# EAGLE design main4 (EAGLE 7.5.0)
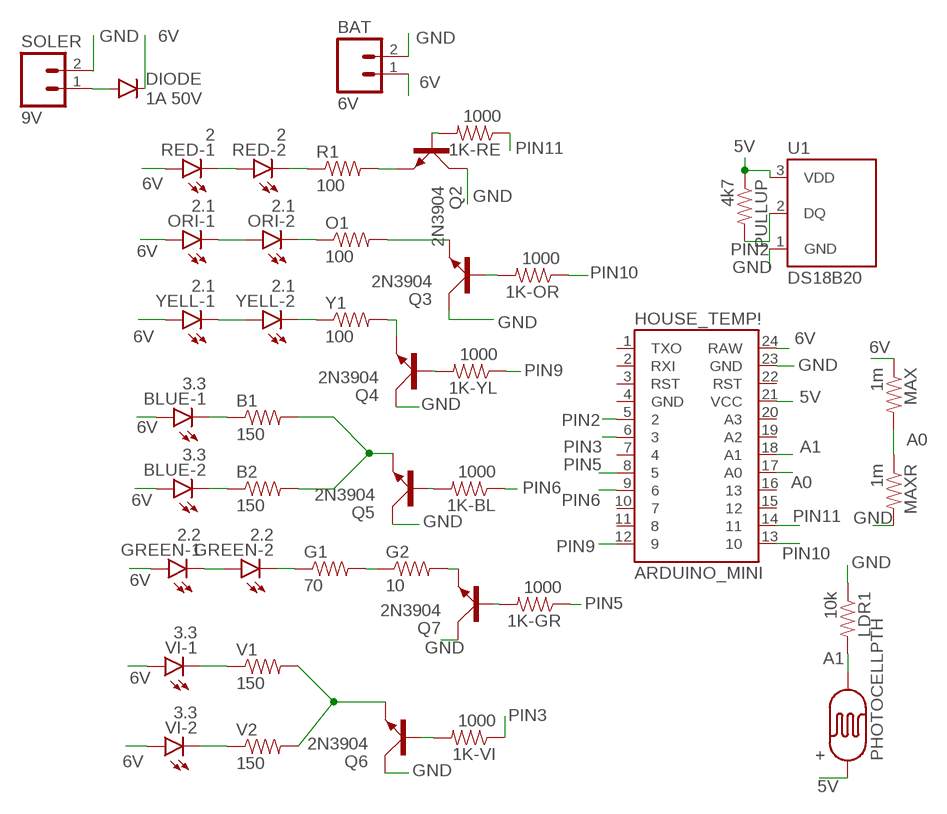
[diagram p0: schematic, sheet 1]

## Parts
1K-BL  1000  RESISTORAXIAL-0.3  [AXIAL-0.3]
1K-GR  1000  RESISTORAXIAL-0.3  [AXIAL-0.3]
1K-OR  1000  RESISTORAXIAL-0.3  [AXIAL-0.3]
1K-RE  1000  RESISTORAXIAL-0.3  [AXIAL-0.3]
1K-VI  1000  RESISTORAXIAL-0.3  [AXIAL-0.3]
1K-YL  1000  RESISTORAXIAL-0.3  [AXIAL-0.3]
+  PHOTOCELLPTH  [PHOTOCELL]
B1  150  RESISTORAXIAL-0.3  [AXIAL-0.3]
B2  150  RESISTORAXIAL-0.3  [AXIAL-0.3]
BAT  6V  M02PTH  [1X02]
BLUE-1  3.3  LED10MM  [LED10MM]
BLUE-2  3.3  LED10MM  [LED10MM]
DIODE  1A 50V  DIODEPTH  [DIODE-1N4001]
G1  70  RESISTORAXIAL-0.3  [AXIAL-0.3]
G2  10  RESISTORAXIAL-0.3  [AXIAL-0.3]
GREEN-1  2.2  LED10MM  [LED10MM]
GREEN-2  2.2  LED10MM  [LED10MM]
HOUSE_TEMP!  ARDUINO_MINI  [ARDUINO_MINI]
LDR1  10k  RESISTORAXIAL-0.3  [AXIAL-0.3]
MAX  1m  RESISTORAXIAL-0.3  [AXIAL-0.3]
MAXR  1m  RESISTORAXIAL-0.3  [AXIAL-0.3]
O1  100  RESISTORAXIAL-0.3  [AXIAL-0.3]
ORI-1  2.1  LED10MM  [LED10MM]
ORI-2  2.1  LED10MM  [LED10MM]
PULLUP  4k7  RESISTORAXIAL-0.3  [AXIAL-0.3]
Q2  2N3904  [TO92D]
Q3  2N3904  [TO92D]
Q4  2N3904  [TO92D]
Q5  2N3904  [TO92D]
Q6  2N3904  [TO92D]
Q7  2N3904  [TO92D]
R1  100  RESISTORAXIAL-0.3  [AXIAL-0.3]
RED-1  2  LED10MM  [LED10MM]
RED-2  2  LED10MM  [LED10MM]
SOLER  9V  M02PTH  [1X02]
U1  DS18B20  [TO-92-AMMO]
V1  150  RESISTORAXIAL-0.3  [AXIAL-0.3]
V2  150  RESISTORAXIAL-0.3  [AXIAL-0.3]
VI-1  3.3  LED10MM  [LED10MM]
VI-2  3.3  LED10MM  [LED10MM]
Y1  100  RESISTORAXIAL-0.3  [AXIAL-0.3]
YELL-1  2.1  LED10MM  [LED10MM]
YELL-2  2.1  LED10MM  [LED10MM]

## Nets
5V: +.1 HOUSE_TEMP!.21(VCC) PULLUP.P$1 U1.3(VDD)
6V: BAT.1 BLUE-1.A BLUE-2.A DIODE.C GREEN-1.A HOUSE_TEMP!.24(RAW) MAX.P$1 ORI-1.A RED-1.A VI-1.A VI-2.A YELL-1.A
A0: HOUSE_TEMP!.17(A0) MAX.P$2 MAXR.P$1
A1: +.2 HOUSE_TEMP!.18(A1) LDR1.P$2
BLU: B1.P$1 BLUE-1.C
BLU2: B2.P$1 BLUE-2.C
GND: BAT.2 HOUSE_TEMP!.23(GND) LDR1.P$1 MAXR.P$2 Q2.C Q3.C Q4.C Q5.C Q6.C Q7.C SOLER.2 U1.1(GND)
GREEN-2: G1.P$1 GREEN-2.C
GREN: GREEN-1.C GREEN-2.A
N$5: R1.P$1 RED-2.C
N$6: DIODE.A SOLER.1
N$7: Y1.P$1 YELL-2.C
N$9: Q4.E Y1.P$2
N$12: B1.P$2 B2.P$2 Q5.E
N$14: Q6.E V1.P$2 V2.P$2
N$15: Q2.E R1.P$2
N$16: O1.P$2 Q3.E
N$17: G1.P$2 G2.P$1
N$18: G2.P$2 Q7.E
N$20: 1K-VI.P$2 Q6.B
N$21: 1K-GR.P$2 Q7.B
N$22: 1K-BL.P$2 Q5.B
N$23: 1K-YL.P$2 Q4.B
N$24: 1K-OR.P$2 Q3.B
N$25: 1K-RE.P$2 Q2.B
O1: O1.P$1 ORI-2.C
ORI: ORI-1.C ORI-2.A
PIN2: HOUSE_TEMP!.5 PULLUP.P$2 U1.2(DQ)
PIN3: 1K-VI.P$1 HOUSE_TEMP!.6
PIN5: 1K-GR.P$1 HOUSE_TEMP!.8
PIN6: 1K-BL.P$1 HOUSE_TEMP!.9
PIN9: 1K-YL.P$1 HOUSE_TEMP!.12
PIN10: 1K-OR.P$1 HOUSE_TEMP!.13
PIN11: 1K-RE.P$1 HOUSE_TEMP!.14
RED: RED-1.C RED-2.A
VI: V1.P$1 VI-1.C
VI2: V2.P$1 VI-2.C
YEL: YELL-1.C YELL-2.A
Unconnected: HOUSE_TEMP!.1(TXO) HOUSE_TEMP!.2(RXI) HOUSE_TEMP!.3(RST) HOUSE_TEMP!.4(GND) HOUSE_TEMP!.7 HOUSE_TEMP!.10 HOUSE_TEMP!.11 HOUSE_TEMP!.15 HOUSE_TEMP!.16 HOUSE_TEMP!.19(A2) HOUSE_TEMP!.20(A3) HOUSE_TEMP!.22(RST)

## Library data of the parts
1K-BL 1K-GR 1K-OR 1K-RE 1K-VI 1K-YL B1 MAX MAXR O1 PULLUP R1 V1 Y1 = SparkFun-Passives:RESISTOR: Resistor Basic schematic elements and footprints for 0603, 1206, and PTH resistors.
+ = SparkFun-Sensors:PHOTOCELL: CdS photoresistor. This is a low cost way to detect light levels. Resistance decreases with more incoming light. SparkFun SKU: SEN-09088
B2 G1 G2 LDR1 V2 = SparkFun-Resistors:RESISTOR: Resistor Basic schematic elements and footprints for 0603, 1206, and PTH resistors.
BAT SOLER = SparkFun-Connectors:M02: Standard 2-pin 0.1" header. Use with - straight break away headers ( PRT-00116) - right angle break away headers (PRT-00553) - swiss pins (PRT-00743) - machine pins (PRT-00117) - female headers (PRT-00115) Molex polarized connector foot print use with: PRT-08233 with associated crimp pins and housings. 2.54_SCREWTERM for use with PRT-10571. 3.5mm Screw Terminal footprints for PRT-08084 5mm Screw Terminal footprints for use with PRT-08432
BLUE-1 BLUE-2 GREEN-1 GREEN-2 ORI-1 ORI-2 RED-1 RED-2 VI-1 VI-2 YELL-1 YELL-2 = SparkFun-LED:LED: LEDs Standard schematic elements and footprints for 5mm, 3mm, 1206, and 0603 sized LEDs. 5mm - Spark Fun Electronics SKU : COM-00529 (and others)
DIODE = SparkFun-DiscreteSemi:DIODE: Diode These are standard reverse protection diodes and small signal diodes. SMA package can handle up to about 1A. SOD-323 can handle about 200mA. What the SOD-323 package when ordering, there are some mfgs out there that are 5-pin packages.
HOUSE_TEMP! = SparkFun-Boards:ARDUINO_MINI: Arduino Pro Mini footprint
Q2-Q7 = transistor-small-signal:2N3904: NPN TRANSISTOR
U1 = SparkFun-Sensors:DS18B20: Dallas/Maxim DS18B20 1-wire temperature sensor Datasheet: http://datasheets.maximintegrated.com/en/ds/DS18B20.pdf temp thermometer 1-wire one-wire one wire; STORE_ID: SEN-00245

## Board
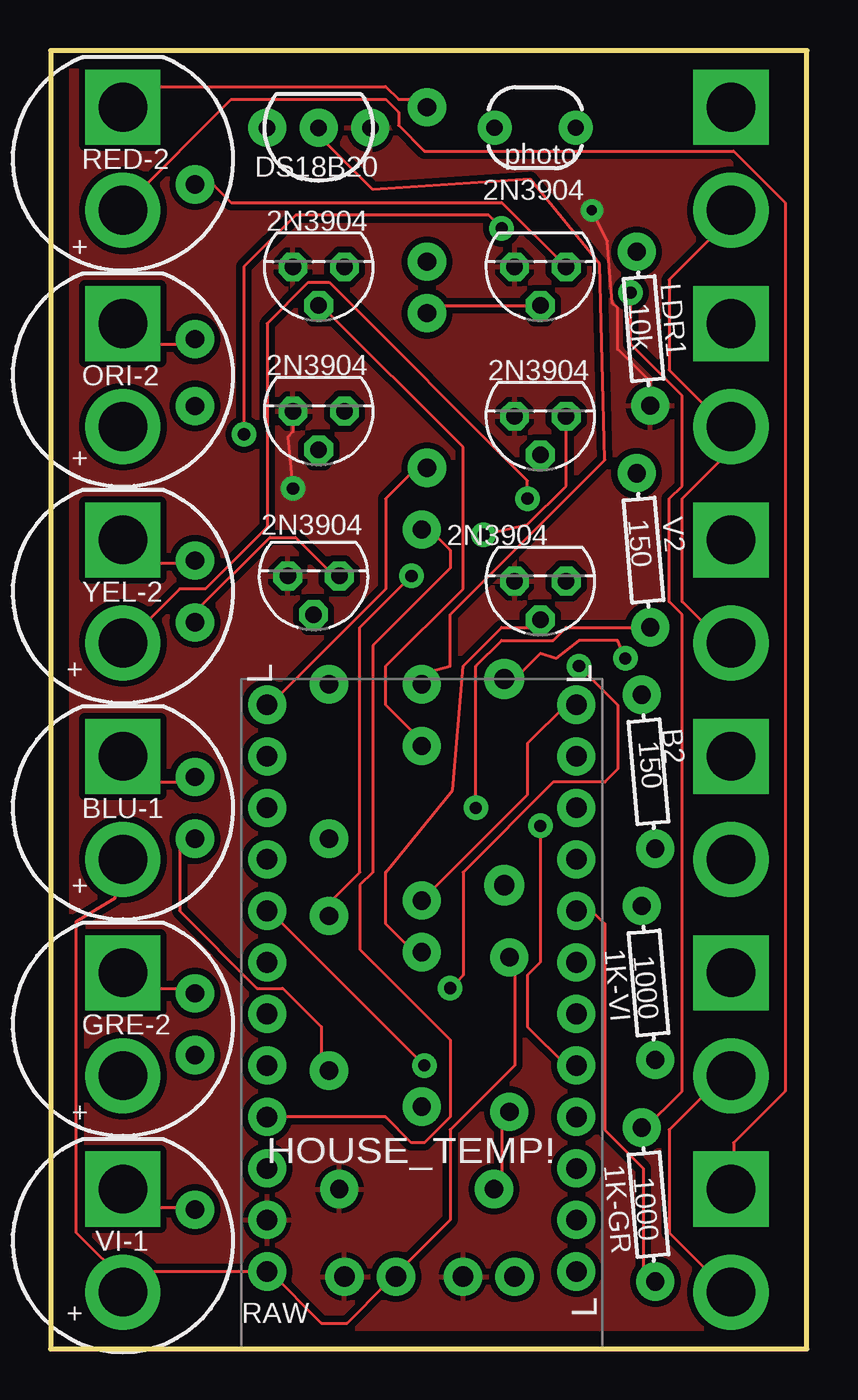
[diagram p1: board, top side]
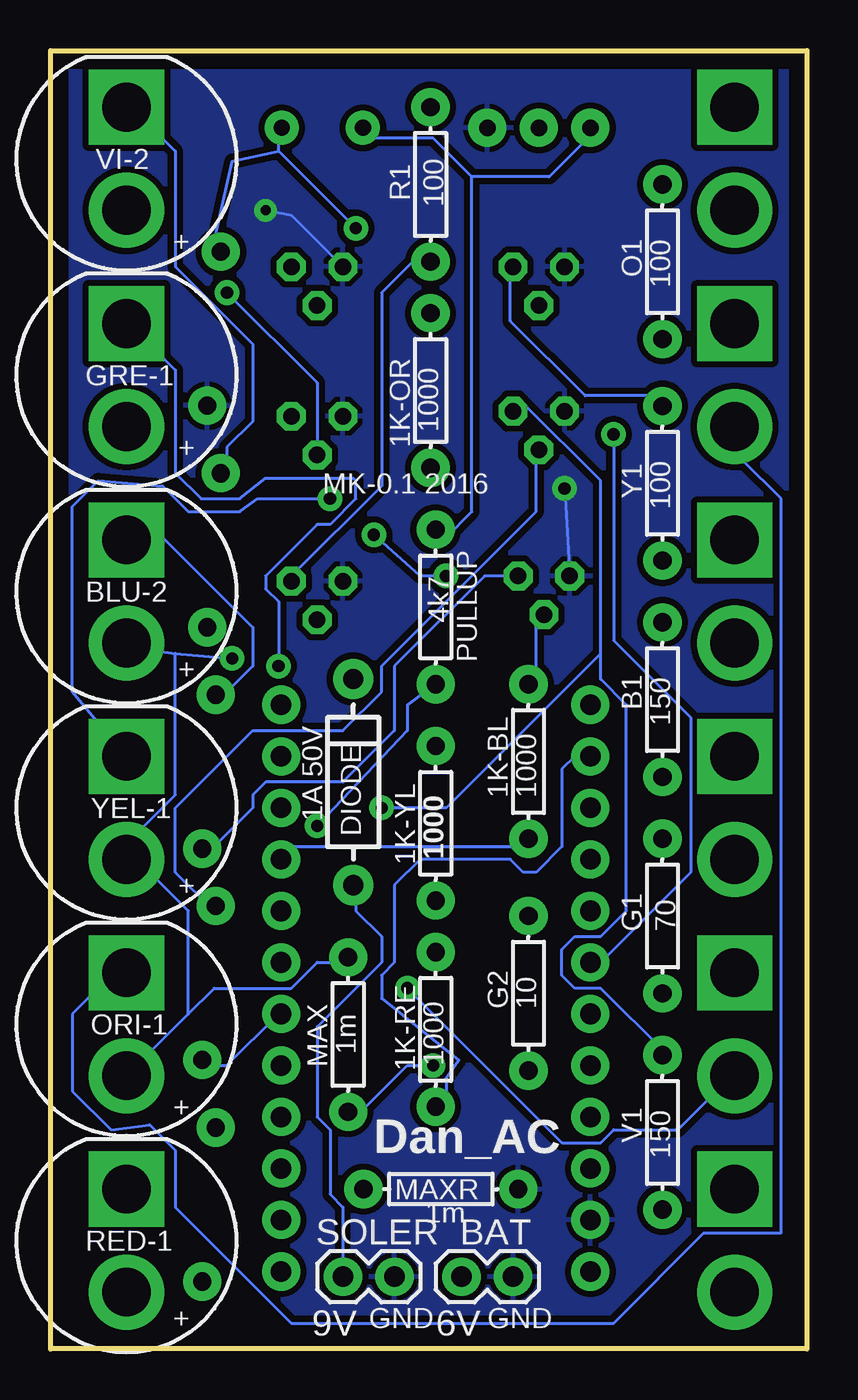
[diagram p2: board, bottom side, seen from below]

Size 37.26 x 64 mm. Coordinates in mm from the lower left corner, seen from the top.
Outline: 0,0 37.26,0 37.26,64 0,64 0,0
Copper layers (1*16): Top 0.035mm / dielectric 1.5mm / Bottom 0.035mm
Design rules "default *": minimum track width 6mil, minimum drill 0.5mm, track to track 8mil, track to pad 8mil, pad to pad 8mil, via to via 8mil, smd to smd 8mil, copper to edge 30mil, drill to drill 8mil, minimum pad ring 12mil, minimum via ring 12mil, stop-mask expansion 8mil, vias tented up to drill 25mil, thermal gap 10mil

### Footprints (pad centres in the part's own frame; a part is rotated, then mirrored left to right if it is on the bottom)
AXIAL-0.3 = drill 0.9 pad 1.88: P$1 -3.81,0; P$2 3.81,0
PHOTOCELL = drill 0.8 pad 1.676: 1 -2,0; 2 2,0
1X02 = drill 1.016 pad 1.88: 1 0,0; 2 2.54,0
LED10MM = drill 2.4 pad 3.7: A 2.54,0 | drill 2.4 pad 3.7 square: C -2.54,0
DIODE-1N4001 = drill 1 pad 1.981: A -5.08,0; C 5.08,0
ARDUINO_MINI = drill 1.016 pad 1.88: 1 -7.62,12.7; 2 -7.62,10.16; 3 -7.62,7.62; 4 -7.62,5.08; 5 -7.62,2.54; 6 -7.62,0; 7 -7.62,-2.54; 8 -7.62,-5.08; 9 -7.62,-7.62; 10 -7.62,-10.16; 11 -7.62,-12.7; 12 -7.62,-15.24; 13 7.62,-15.24; 14 7.62,-12.7; 15 7.62,-10.16; 16 7.62,-7.62; 17 7.62,-5.08; 18 7.62,-2.54; 19 7.62,0; 20 7.62,2.54; 21 7.62,5.08; 22 7.62,7.62; 23 7.62,10.16; 24 7.62,12.7
TO92D = drill 0.813 octagon: B 0,1.905; C 1.27,0; E -1.27,0
TO-92-AMMO = drill 0.813 pad 1.88: 1 -2.54,0; 2 0,0; 3 2.54,0

### Placement (x,y rotation side)
1K-BL  13.72,28.96 90 bottom
1K-GR  29.46,7.11 95 top
1K-OR  18.54,47.24 90 bottom
1K-RE  18.29,15.75 90 bottom
1K-VI  29.46,18.03 95 top
1K-YL  18.29,25.91 90 bottom
+  23.88,60.2 0 top
B1  7.11,32 90 bottom
B2  29.46,28.45 275 top
BAT  17.02,3.56 0 bottom
BLUE-1  3.56,26.67 270 top
BLUE-2  33.53,37.34 270 bottom
DIODE  22.35,27.94 90 bottom
G1  7.11,21.34 90 bottom
G2  13.72,17.53 90 bottom
GREEN-1  33.53,48.01 270 bottom
GREEN-2  3.56,16 270 top
HOUSE_TEMP!  18.29,16.51 180 top
LDR1  29.21,50.29 95 top
MAX  22.61,15.49 270 bottom
MAXR  18.03,7.87 0 bottom
O1  7.11,53.59 90 bottom
ORI-1  33.53,16 270 bottom
ORI-2  3.56,48.01 270 top
PULLUP  18.29,36.58 270 bottom
Q2  24.13,37.85 180 top
Q3  24.13,53.34 180 top
Q4  13.21,53.34 180 top
Q5  12.95,38.1 180 top
Q6  13.21,46.23 180 top
Q7  24.13,45.97 180 top
R1  18.54,57.4 270 bottom
RED-1  33.53,5.33 270 bottom
RED-2  3.56,58.67 270 top
SOLER  22.86,3.56 0 bottom
U1  13.21,60.2 180 top
V1  7.11,10.67 90 bottom
V2  29.21,39.37 275 top
VI-1  3.56,5.33 270 top
VI-2  33.53,58.67 270 bottom
Y1  7.11,42.67 90 bottom
YELL-1  33.53,26.67 270 bottom
YELL-2  3.56,37.34 270 top

### Tracks (layer width: path | path; a pad name or v marks a point on that pad's centre or on a via)
5V
  Top 0.152: HOUSE_TEMP!.21 16.51,11.43 17.78,10.16 18.41,10.16 19.68,11.43 19.68,15.24 15.24,19.69 15.24,22.86 15.88,23.5 15.88,34.67 19.68,38.48 19.68,39.37 18.41,40.64 PULLUP.P$1
  Bottom 0.152: 16.51,57.78 18.41,59.69 21.59,59.69 +.1 | 16.51,57.78 12.7,57.78 10.79,59.69 U1.3 | 16.51,57.78 16.51,41.27 17.78,40 PULLUP.P$1
6V  (via drill 0.6 pad 0.25)
  Top 0.152: 3.81,3.18 4.45,3.81 HOUSE_TEMP!.24 10.79,3.81 13.34,1.27 14.61,1.27 16.51,3.18 BAT.1 17.14,3.81 19.68,6.35 19.68,10.79 22.86,13.97 22.86,19.05 MAX.P$1 | 3.81,3.18 1.27,5.71 1.27,21.08 3.17,22.23 3.17,24.13 BLUE-1.A | 3.81,3.18 VI-1.A | VI-2.A 33.66,55.88 30.48,52.7 30.48,48.26 33.02,45.72 GREEN-1.A 33.53,45.09 33.02,43.81 31.11,41.91 31.11,36.83 33.02,34.92 BLUE-2.A | v28.32,34.04 27.94,34.92 26.04,34.92 24.89,34.04 24.13,34.29 22.86,33.02 DIODE.C | RED-1.A 33.02,3.18 30.48,5.71 30.48,10.79 33.02,13.33 ORI-1.A
  Bottom 0.152: 31.11,34.29 33.02,34.54 BLUE-2.A | 31.11,34.29 v28.32,34.04 | ORI-1.A 30.48,16.51 | 30.48,16.51 29.21,17.78 25.4,17.78 24.13,19.05 22.86,19.05 MAX.P$1 | 33.02,24.13 30.48,21.59 30.48,16.51 | 31.11,34.29 31.11,27.3 33.02,25.4 33.02,24.13 | 33.02,24.13 YELL-1.A
A0  (via drill 0.6 pad 0.25)
  Top 0.152: MAXR.P$1 22.23,8.25 22.23,11.43 MAX.P$2 | v18.41,13.97 10.79,21.59 HOUSE_TEMP!.17
  Bottom 0.152: v18.41,13.97 19.68,13.97 22.23,11.43 MAX.P$2
A1  (via drill 0.6 pad 0.25)
  Top 0.152: v9.53,45.09 9.53,53.34 12.06,55.88 21.59,55.88 v22.23,55.24
  Bottom 0.152: 26.04,59.05 28.32,58.55 29.21,54.61 LDR1.P$2 | 26.04,59.05 26.04,59.69 +.2 | v9.53,45.09 9.53,34.92 5.71,31.11 5.71,23.5 10.16,19.05 HOUSE_TEMP!.18 | 26.04,59.05 v22.23,55.24
BLU
  Top 0.152: B1.P$1 6.99,27.94 5.08,27.94 3.81,29.21 BLUE-1.C
BLU2
  Bottom 0.152: B2.P$1 28.57,32.38 27.3,33.66 27.3,35.56 31.75,40 33.02,40 BLUE-2.C
GND  (via drill 0.5 pad 0.25, 0.6 pad 0.25)
  Top 0.152: LDR1.P$1 29.54,47.67 27.94,49.28 27.94,51.31 27.69,51.56 27.43,54.61 v26.67,56.13 | Q6.C 11.94,45.21 11.68,44.96 v11.94,42.42
  Bottom 0.152: v26.67,56.13 25.4,55.88 Q3.C | v11.94,42.42 Q5.C
  pour Top (isolate 0.305): 0,64.01 37.34,64.01 37.34,0 0,0
  pour Bottom (isolate 0.305): 0,64.01 37.34,64.01 37.34,0 0,0
GREEN-2
  Top 0.152: G1.P$1 6.99,17.78 4.45,17.78 3.81,18.42 GREEN-2.C
GREN  (via drill 0.6 pad 0.25)
  Top 0.152: v19.68,17.78 20.32,18.42 20.32,23.5 24.77,27.94 27.3,27.94 27.94,28.57 27.94,31.75 v26.04,33.66
  Bottom 0.152: v19.68,17.78 12.06,10.16 10.16,10.16 9.53,10.79 6.35,10.79 3.81,13.33 GREEN-2.A | v26.04,33.66 26.04,36.83 26.67,37.46 26.67,38.1 24.13,40.64 23.5,40.64 22.23,41.91 22.23,42.8 22.35,42.93 26.67,42.93 27.94,41.91 29.84,41.91 31.11,43.18 31.11,48.26 33.02,50.16 GREEN-1.C
N$5
  Top 0.152: R1.P$1 18.41,61.59 17.14,61.59 16.51,62.23 4.45,62.23 3.81,61.59 RED-2.C
N$6
  Bottom 0.152: SOLER.1 22.86,6.98 23.5,7.62 23.5,10.79 24.13,11.43 24.13,15.87 20.95,19.05 20.95,20.32 22.23,21.59 22.23,22.86 DIODE.A
N$7
  Top 0.152: Y1.P$1 6.99,38.73 4.45,38.73 3.81,39.37 YELL-2.C
N$9
  Bottom 0.152: Q4.E 14.61,53.34 14.61,50.67 10.92,46.99 7.62,46.99 Y1.P$2
N$12
  Top 0.152: Q5.E 13.97,38.1 12.06,40 10.79,40 6.99,36.2 B1.P$2
  Bottom 0.152: Q5.E 15.88,38.1 20.32,33.66 20.32,30.48 22.86,27.94 26.67,27.94 27.3,27.3 27.3,26.67 29.21,24.77 B2.P$2
N$14  (via drill 0.6 pad 0.25)
  Top 0.152: v20.95,26.67 20.95,33.66 22.23,34.92 24.77,34.92 25.4,35.56 29.21,35.56 V2.P$2
  Bottom 0.152: 10.16,34.29 10.16,33.02 8.89,31.75 8.89,21.59 10.16,20.32 11.43,20.32 12.06,19.69 12.06,18.42 11.43,17.78 10.16,17.78 6.99,14.6 V1.P$2 | 10.16,34.29 10.16,42.8 13.97,46.61 Q6.E | v20.95,26.67 17.78,26.67 10.16,34.29
N$15
  Bottom 0.152: Q2.E 25.4,38.1 20.95,42.54 20.95,52.07 19.05,53.97 R1.P$2
N$16
  Top 0.152: Q3.E 22.23,56.52 8.89,56.52 7.62,57.78 O1.P$2
N$17
  Top 0.152: G2.P$1 13.34,13.97 13.34,15.87 11.43,17.78 10.16,17.78 6.35,21.59 6.35,24.77 6.99,25.4 G1.P$2
N$18  (via drill 0.6 pad 0.25)
  Top 0.152: Q7.E 25.4,42.54 23.5,40.64 v21.34,40.13 | v17.78,38.1 15.24,35.56 15.24,23.5 13.34,21.59 G2.P$2
  Bottom 0.152: v21.34,40.13 19.05,38.1 v17.78,38.1
N$20
  Bottom 0.152: Q6.B 13.34,43.81 13.34,41.27 20.95,33.66 20.95,32.38 22.86,30.48 27.3,30.48 31.11,26.67 31.11,23.5 29.21,21.59 1K-VI.P$2
N$21  (via drill 0.6 pad 0.25)
  Top 0.152: v28.57,52.07 28.57,49.53 31.11,46.99 31.11,42.54 30.48,41.91 30.48,36.83 31.11,36.2 31.11,12.7 29.21,10.79 1K-GR.P$2
  Bottom 0.152: Q7.B 24.13,47.62 v28.57,52.07
N$22
  Bottom 0.152: Q5.B 13.34,36.2 13.34,33.02 1K-BL.P$2
N$23
  Top 0.152: Q4.B 13.34,51.43 20.32,44.45 20.32,37.46 16.51,33.66 16.51,31.75 18.41,29.85 1K-YL.P$2
N$24
  Top 0.152: Q3.B 19.05,51.43 1K-OR.P$2
N$25
  Top 0.152: Q2.B 24.13,35.56 22.23,35.56 20.32,33.66 19.81,27.56 16.51,23.5 16.51,20.96 17.78,19.69 1K-RE.P$2
O1
  Top 0.152: O1.P$1 6.99,49.53 4.45,49.53 3.81,50.16 ORI-2.C
ORI
  Bottom 0.152: ORI-2.A 3.17,45.09 3.17,43.81 1.27,41.91 1.27,5.71 5.08,5.71 9.53,1.27 25.4,1.27 31.11,6.98 31.11,9.78 32.38,11.05 34.29,10.79 36.2,12.7 36.2,16.51 33.66,19.05 ORI-1.C
PIN2  (via drill 0.6 pad 0.25)
  Top 0.152: v24.13,25.78 24.13,19.05 23.5,18.42 23.5,15.87 25.4,13.97 HOUSE_TEMP!.5 | U1.2 13.34,59.69 15.88,57.15 23.62,57.66 27.05,53.47 27.3,43.81 19.68,36.2 19.68,33.66 18.67,33.4 PULLUP.P$2
  Bottom 0.152: v24.13,25.78 19.68,30.48 19.68,31.75 18.67,32.51 PULLUP.P$2
PIN3
  Bottom 0.152: HOUSE_TEMP!.6 26.04,16.51 28.57,13.97 29.21,13.97 1K-VI.P$1
PIN5
  Top 0.152: HOUSE_TEMP!.8 26.67,21.59 27.3,20.96 27.3,10.79 29.21,8.89 29.21,3.81 1K-GR.P$1
PIN6
  Bottom 0.152: 1K-BL.P$1 13.97,24.77 25.4,24.77 26.04,24.13 HOUSE_TEMP!.9
PIN9
  Top 0.152: 1K-YL.P$1 23.5,27.3 23.5,29.85 25.4,31.75 HOUSE_TEMP!.12
PIN10
  Top 0.152: HOUSE_TEMP!.13 10.79,31.75 16.51,37.46 16.51,41.91 18.41,43.81 1K-OR.P$1
PIN11
  Bottom 0.152: HOUSE_TEMP!.14 11.43,29.21 12.06,28.57 12.06,24.77 13.34,23.5 13.97,23.5 14.61,24.13 19.05,24.13 20.32,22.86 20.32,19.05 20.95,18.42 20.95,17.27 17.14,14.22 17.78,13.33 17.78,12.06 1K-RE.P$1
RED
  Top 0.152: RED-1.C 33.66,8.25 33.66,10.16 36.2,12.7 36.2,56.52 33.66,59.05 18.41,59.05 17.14,60.33 17.14,60.96 16.51,61.59 8.89,61.59 3.81,56.52 RED-2.A
VI
  Top 0.152: VI-1.C 4.45,6.98 6.99,6.98 V1.P$1
VI2
  Bottom 0.152: V2.P$1 28.57,43.18 28.57,44.45 27.3,45.72 27.3,49.53 31.11,53.34 31.11,59.05 33.02,60.96 VI-2.C
YEL  (via drill 0.6 pad 0.25)
  Top 0.152: v23.5,41.91 23.5,42.8 13.72,52.58 12.7,52.58 10.67,50.55 10.67,40.51 7.62,37.46 6.35,37.46 3.81,34.92 YELL-2.A
  Bottom 0.152: v23.5,41.91 27.05,41.91 27.94,41.27 30.48,41.27 31.75,42.54 34.92,42.8 36.2,41.53 36.2,32.38 33.78,29.46 YELL-1.C

### Text on the board
tPlace: RED-2 | photo | + | ORI-2 | + | YEL-2 | L | + | L | BLU-1 | + | GRE-2 | + | VI-1 | L | + | RAW
bPlace: VI-2 | + | GRE-1 | + | MK-0.1 2016 | BLU-2 | + | YEL-1 | + | ORI-1 | + | Dan_AC | RED-1 | GND | GND | +